# EAGLE design RndLogo (EAGLE 5.11)
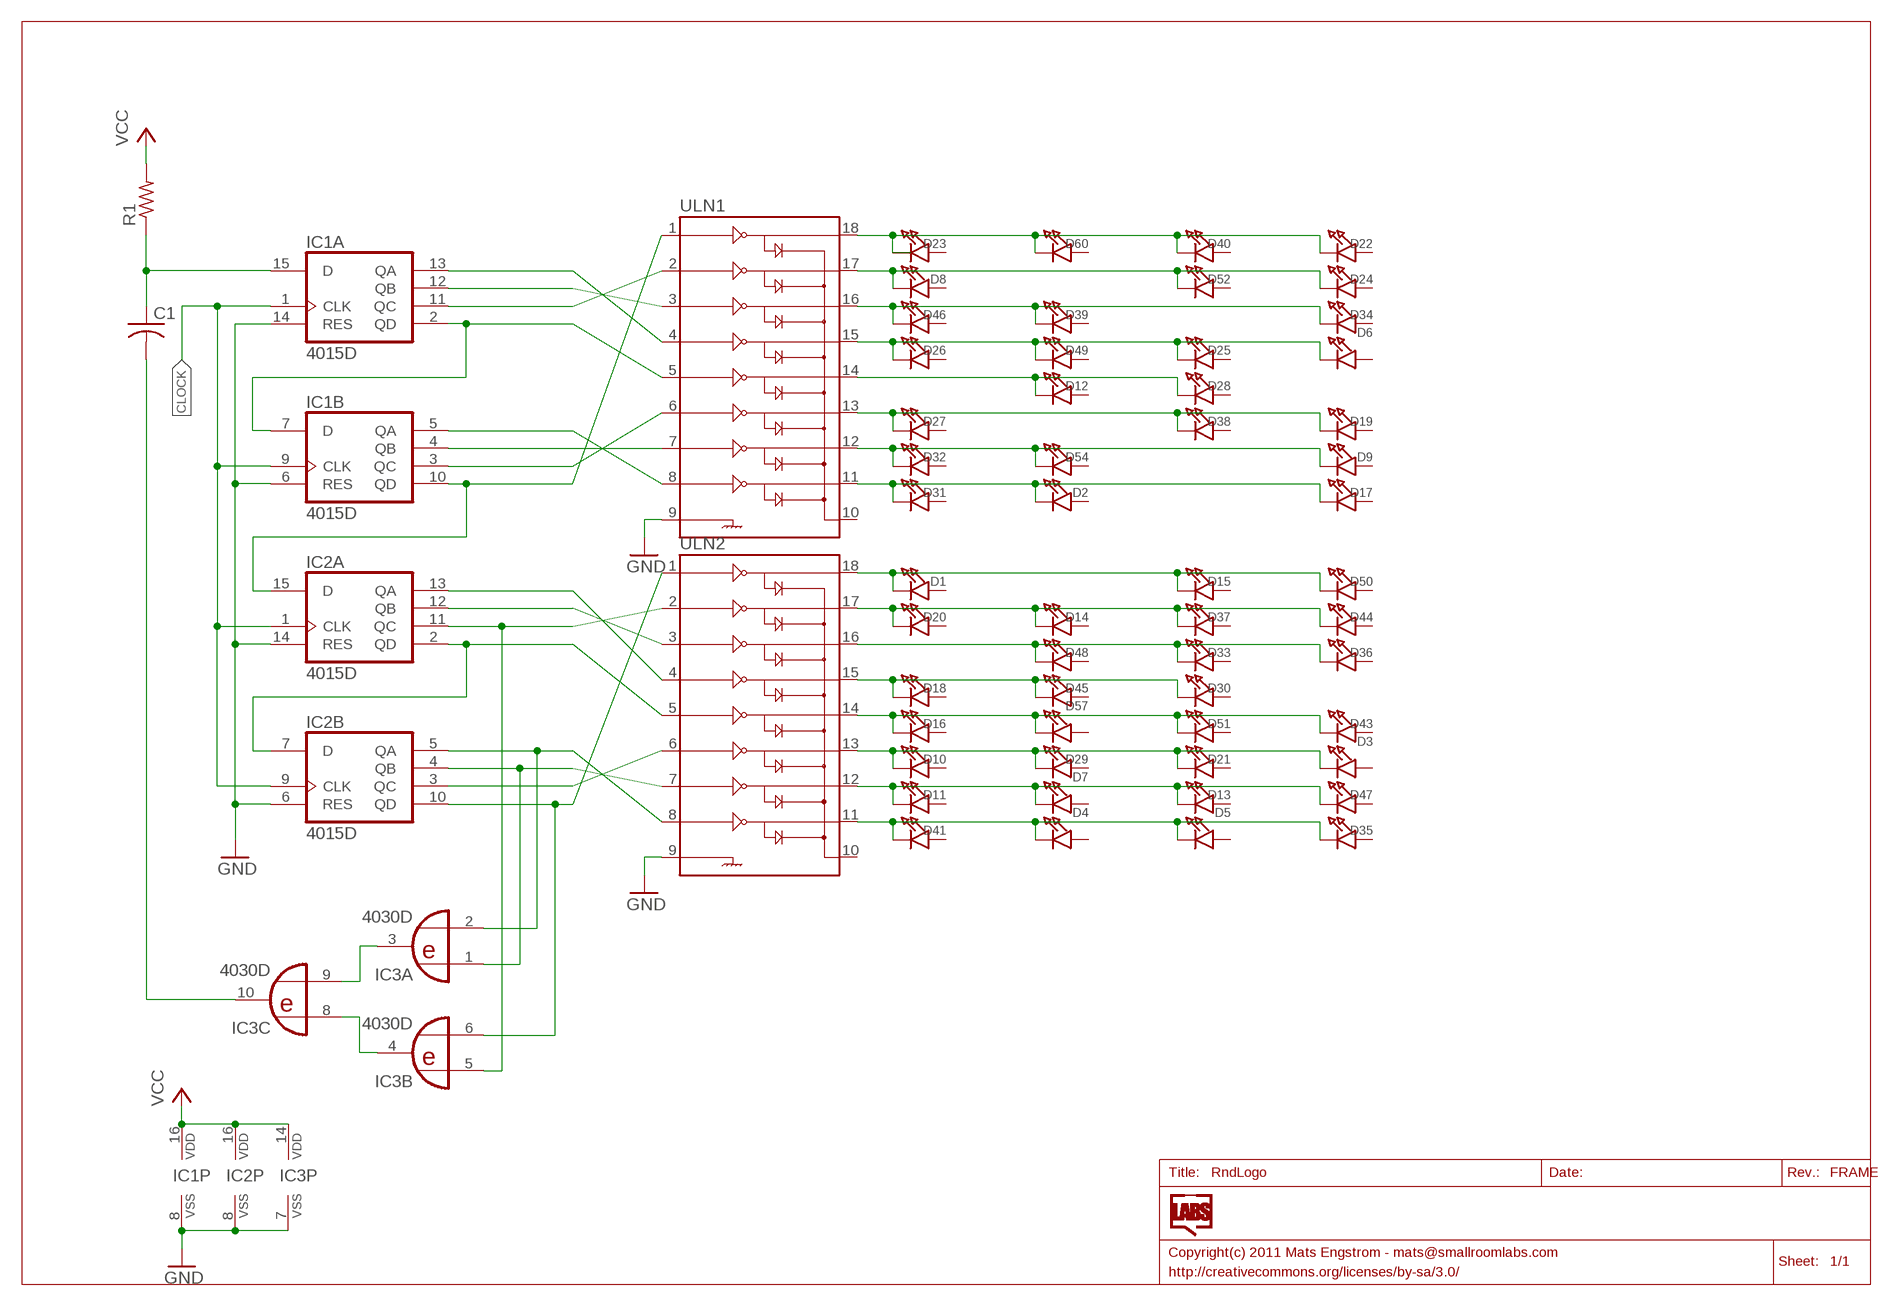
[diagram p0: schematic, sheet 1, part 1 of 2]
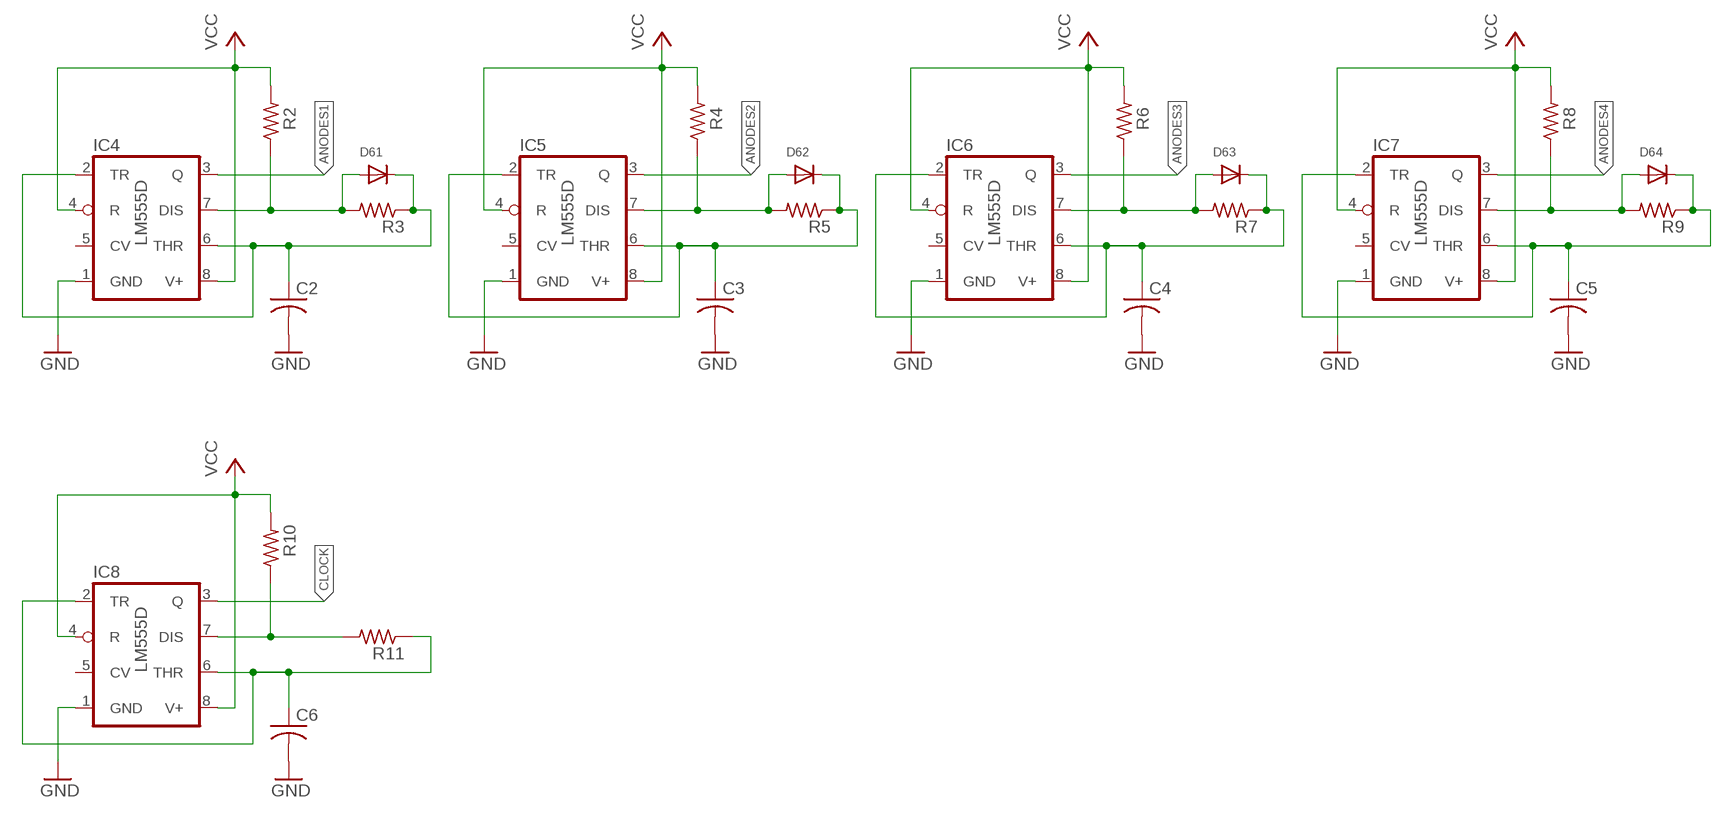
[diagram p1: schematic, sheet 1, part 2 of 2]

## Parts
C1  C-USC0805K  [C0805K]
C2  C-USC0805K  [C0805K]
C3  C-USC0805K  [C0805K]
C4  C-USC0805K  [C0805K]
C5  C-USC0805K  [C0805K]
C6  C-USC0805K  [C0805K]
D1  LEDSMD0805  [CHIPLED_0805]
D2  LEDSMD0805  [CHIPLED_0805]
D3  LEDSMD0805  [CHIPLED_0805]
D4  LEDSMD0805  [CHIPLED_0805]
D5  LEDSMD0805  [CHIPLED_0805]
D6  LEDSMD0805  [CHIPLED_0805]
D7  LEDSMD0805  [CHIPLED_0805]
D8  LEDSMD0805  [CHIPLED_0805]
D9  LEDSMD0805  [CHIPLED_0805]
D10  LEDSMD0805  [CHIPLED_0805]
D11  LEDSMD0805  [CHIPLED_0805]
D12  LEDSMD0805  [CHIPLED_0805]
D13  LEDSMD0805  [CHIPLED_0805]
D14  LEDSMD0805  [CHIPLED_0805]
D15  LEDSMD0805  [CHIPLED_0805]
D16  LEDSMD0805  [CHIPLED_0805]
D17  LEDSMD0805  [CHIPLED_0805]
D18  LEDSMD0805  [CHIPLED_0805]
D19  LEDSMD0805  [CHIPLED_0805]
D20  LEDSMD0805  [CHIPLED_0805]
D21  LEDSMD0805  [CHIPLED_0805]
D22  LEDSMD0805  [CHIPLED_0805]
D23  LEDSMD0805  [CHIPLED_0805]
D24  LEDSMD0805  [CHIPLED_0805]
D25  LEDSMD0805  [CHIPLED_0805]
D26  LEDSMD0805  [CHIPLED_0805]
D27  LEDSMD0805  [CHIPLED_0805]
D28  LEDSMD0805  [CHIPLED_0805]
D29  LEDSMD0805  [CHIPLED_0805]
D30  LEDSMD0805  [CHIPLED_0805]
D31  LEDSMD0805  [CHIPLED_0805]
D32  LEDSMD0805  [CHIPLED_0805]
D33  LEDSMD0805  [CHIPLED_0805]
D34  LEDSMD0805  [CHIPLED_0805]
D35  LEDSMD0805  [CHIPLED_0805]
D36  LEDSMD0805  [CHIPLED_0805]
D37  LEDSMD0805  [CHIPLED_0805]
D38  LEDSMD0805  [CHIPLED_0805]
D39  LEDSMD0805  [CHIPLED_0805]
D40  LEDSMD0805  [CHIPLED_0805]
D41  LEDSMD0805  [CHIPLED_0805]
D43  LEDSMD0805  [CHIPLED_0805]
D44  LEDSMD0805  [CHIPLED_0805]
D45  LEDSMD0805  [CHIPLED_0805]
D46  LEDSMD0805  [CHIPLED_0805]
D47  LEDSMD0805  [CHIPLED_0805]
D48  LEDSMD0805  [CHIPLED_0805]
D49  LEDSMD0805  [CHIPLED_0805]
D50  LEDSMD0805  [CHIPLED_0805]
D51  LEDSMD0805  [CHIPLED_0805]
D52  LEDSMD0805  [CHIPLED_0805]
D54  LEDSMD0805  [CHIPLED_0805]
D57  LEDSMD0805  [CHIPLED_0805]
D60  LEDSMD0805  [CHIPLED_0805]
D61  DIODESOD-123  [SOD-123]
D62  DIODESOD-123  [SOD-123]
D63  DIODESOD-123  [SOD-123]
D64  DIODESOD-123  [SOD-123]
IC1  4015D  [SO16]
IC2  4015D  [SO16]
IC3  4030D  [SO14]
IC4  LM555D  [SO08]
IC5  LM555D  [SO08]
IC6  LM555D  [SO08]
IC7  LM555D  [SO08]
IC8  LM555D  [SO08]
R1  R-US_R0805W  [R0805W]
R2  R-US_R0805W  [R0805W]
R3  R-US_R0805W  [R0805W]
R4  R-US_R0805W  [R0805W]
R5  R-US_R0805W  [R0805W]
R6  R-US_R0805W  [R0805W]
R7  R-US_R0805W  [R0805W]
R8  R-US_R0805W  [R0805W]
R9  R-US_R0805W  [R0805W]
R10  R-US_R0805W  [R0805W]
R11  R-US_R0805W  [R0805W]
ULN1  ULN2803SOICW  [SO18L]
ULN2  ULN2803SOICW  [SO18L]

## Nets
ANODES1: IC4.3(Q)
ANODES2: IC5.3(Q)
ANODES3: IC6.3(Q)
ANODES4: IC7.3(Q)
CLOCK: IC1.1(A:CLK) IC1.9(B:CLK) IC2.1(A:CLK) IC2.9(B:CLK) IC8.3(Q)
GND: C2.2 C3.2 C4.2 C5.2 C6.2 IC1.6(B:RES) IC1.8(P:VSS) IC1.14(A:RES) IC2.6(B:RES) IC2.8(P:VSS) IC2.14(A:RES) IC3.7(P:VSS) IC4.1(GND) IC5.1(GND) IC6.1(GND) IC7.1(GND) IC8.1(GND) ULN1.9 ULN2.9
N$1: D63.A IC6.7(DIS) R6.1 R7.2
N$2: IC3.3(A:O) IC3.9(C:I1)
N$3: IC3.4(B:O) IC3.8(C:I0)
N$4: C1.1 IC1.15(A:D) R1.1
N$5: C4.1 D63.C IC6.2(TR) IC6.6(THR) R7.1
N$6: D62.A IC5.7(DIS) R4.1 R5.2
N$7: C3.1 D62.C IC5.2(TR) IC5.6(THR) R5.1
N$8: C1.2 IC3.10(C:O)
N$9: D22.C D40.C D60.C ULN1.18
N$10: D61.A IC4.7(DIS) R2.1 R3.2
N$11: C2.1 D61.C IC4.2(TR) IC4.6(THR) R3.1
N$12: D64.A IC7.7(DIS) R8.1 R9.2
N$13: C5.1 D64.C IC7.2(TR) IC7.6(THR) R9.1
N$14: IC8.7(DIS) R10.1 R11.2
N$15: C6.1 IC8.2(TR) IC8.6(THR) R11.1
N$16: D8.C D24.C D52.C ULN1.17
N$17: D34.C D39.C D46.C ULN1.16
N$18: D6.C D25.C D26.C D49.C ULN1.15
N$19: D12.C D28.C ULN1.14
N$20: D19.C D27.C D38.C ULN1.13
N$21: D9.C D32.C D54.C ULN1.12
N$22: D2.C D17.C D31.C ULN1.11
N$23: D1.C D15.C D50.C ULN2.18
N$24: D14.C D20.C D37.C D44.C ULN2.17
N$25: D33.C D36.C D48.C ULN2.16
N$26: D18.C D30.C D45.C ULN2.15
N$27: D16.C D43.C D51.C D57.C ULN2.14
N$28: D3.C D10.C D21.C D29.C ULN2.13
N$29: D7.C D11.C D13.C D47.C ULN2.12
N$30: D4.C D5.C D35.C D41.C ULN2.11
RND0: IC1.13(A:QA) ULN1.4
RND1: IC1.12(A:QB) ULN1.3
RND2: IC1.11(A:QC) ULN1.2
RND3: IC1.2(A:QD) IC1.7(B:D) ULN1.5
RND4: IC1.5(B:QA) ULN1.8
RND5: IC1.4(B:QB) ULN1.7
RND6: IC1.3(B:QC) ULN1.6
RND7: IC1.10(B:QD) IC2.15(A:D) ULN1.1
RND8: IC2.13(A:QA) ULN2.4
RND9: IC2.12(A:QB) ULN2.3
RND10: IC2.11(A:QC) IC3.5(B:I0) ULN2.2
RND11: IC2.2(A:QD) IC2.7(B:D) ULN2.5
RND12: IC2.5(B:QA) IC3.2(A:I1) ULN2.8
RND13: IC2.4(B:QB) IC3.1(A:I0) ULN2.7
RND14: IC2.3(B:QC) ULN2.6
RND15: IC2.10(B:QD) IC3.6(B:I1) ULN2.1
VCC: IC1.16(P:VDD) IC2.16(P:VDD) IC3.14(P:VDD) IC4.4(R) IC4.8(V+) IC5.4(R) IC5.8(V+) IC6.4(R) IC6.8(V+) IC7.4(R) IC7.8(V+) IC8.4(R) IC8.8(V+) R1.2 R2.2 R4.2 R6.2 R8.2 R10.2
Unconnected: D1.A D2.A D3.A D4.A D5.A D6.A D7.A D8.A D9.A D10.A D11.A D12.A D13.A D14.A D15.A D16.A D17.A D18.A D19.A D20.A D21.A D22.A D23.A D23.C D24.A D25.A D26.A D27.A D28.A D29.A D30.A D31.A D32.A D33.A D34.A D35.A D36.A D37.A D38.A D39.A D40.A D41.A D43.A D44.A D45.A D46.A D47.A D48.A D49.A D50.A D51.A D52.A D54.A D57.A D60.A IC3.11(D:O) IC3.12(D:I0) IC3.13(D:I1) IC4.5(CV) IC5.5(CV) IC6.5(CV) IC7.5(CV) IC8.5(CV) ULN1.10 ULN2.10

## Library data of the parts
C1-C6 = rcl:C-US: CAPACITOR, American symbol
D1-D41 D43-D52 D54 D57 D60 = SmallRoomLabs:LED
D61-D64 = microbuilder:DIODE: Diode SMADIODE - SMA Surface Mount Package 20V 1A Schottky Diode Digikey (500mV @ 1A, 500uA Vr @ 20V): 641-1014-6-ND SOD-123 30V 500mA (430mV Vf, 130uA Vr @ 30V) Schottky Diode - Digikey: B0530W-FDICT-ND SOD-323 10V 570mA (380mV Vf, 3ns) Schottky Diode - Digikey: ZLLS410CT-ND SOD-523 30V 30mA Schottky Diode (RB751S-40TE61) - Digikey: RB751S-40TE61CT-ND SOT23-R/W - SOT23 Package (R = Solder Paste/Reflow Ovens, W = Hand-Soldering) BAT54Film 40V 300mA - Digikey: 497-7162-1-ND DO-1N4148 Through Hole Small Current Diode (any model)
IC1 IC2 = 40xx:4015: Dual 4-bit static SHIFT REGISTER
IC3 = 40xx:4030: Quad XOR
IC4-IC8 = linear:*555: TIMER
R1-R11 = rcl:R-US_: RESISTOR, American symbol
ULN1 ULN2 = SparkFun:ULN2803: Darlington Driver ULN2803 Darlington array. 500mA max per channel, 8-channel package. Spark Fun Electronics SKU : COM-00312

## Net classes
0 default: width 0.203 mm, drill 0.305 mm, clearance 0.203 mm

## Board
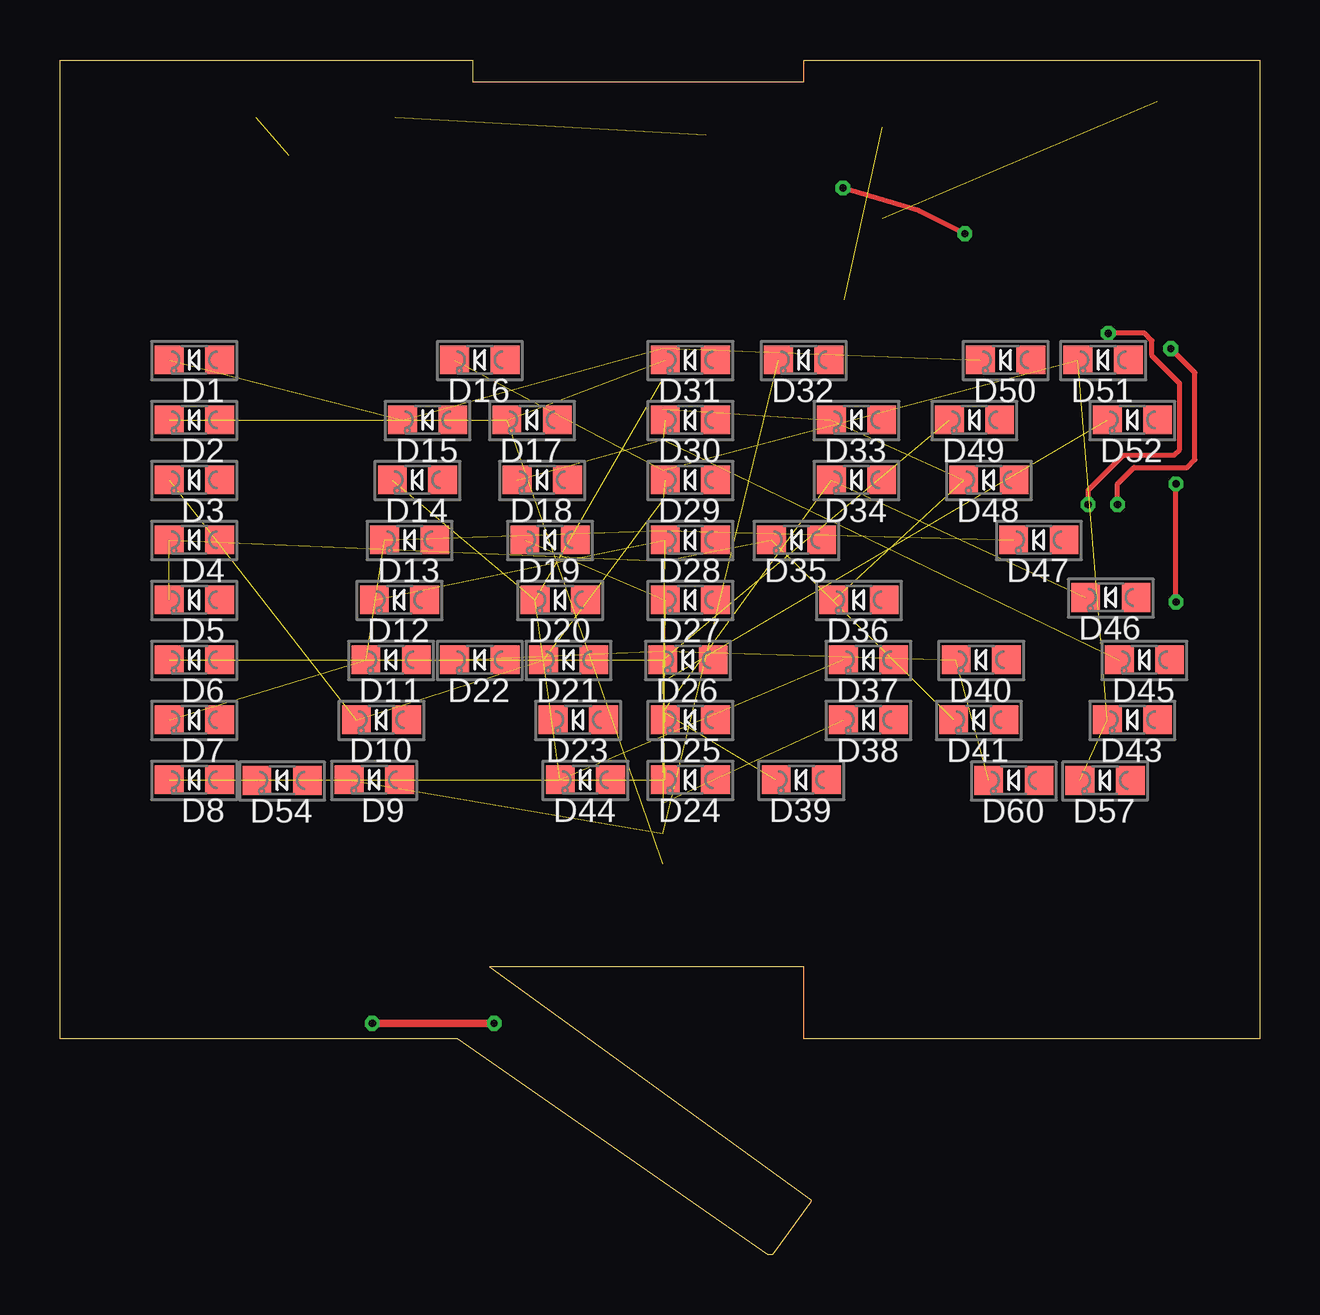
[diagram p2: board, top side]
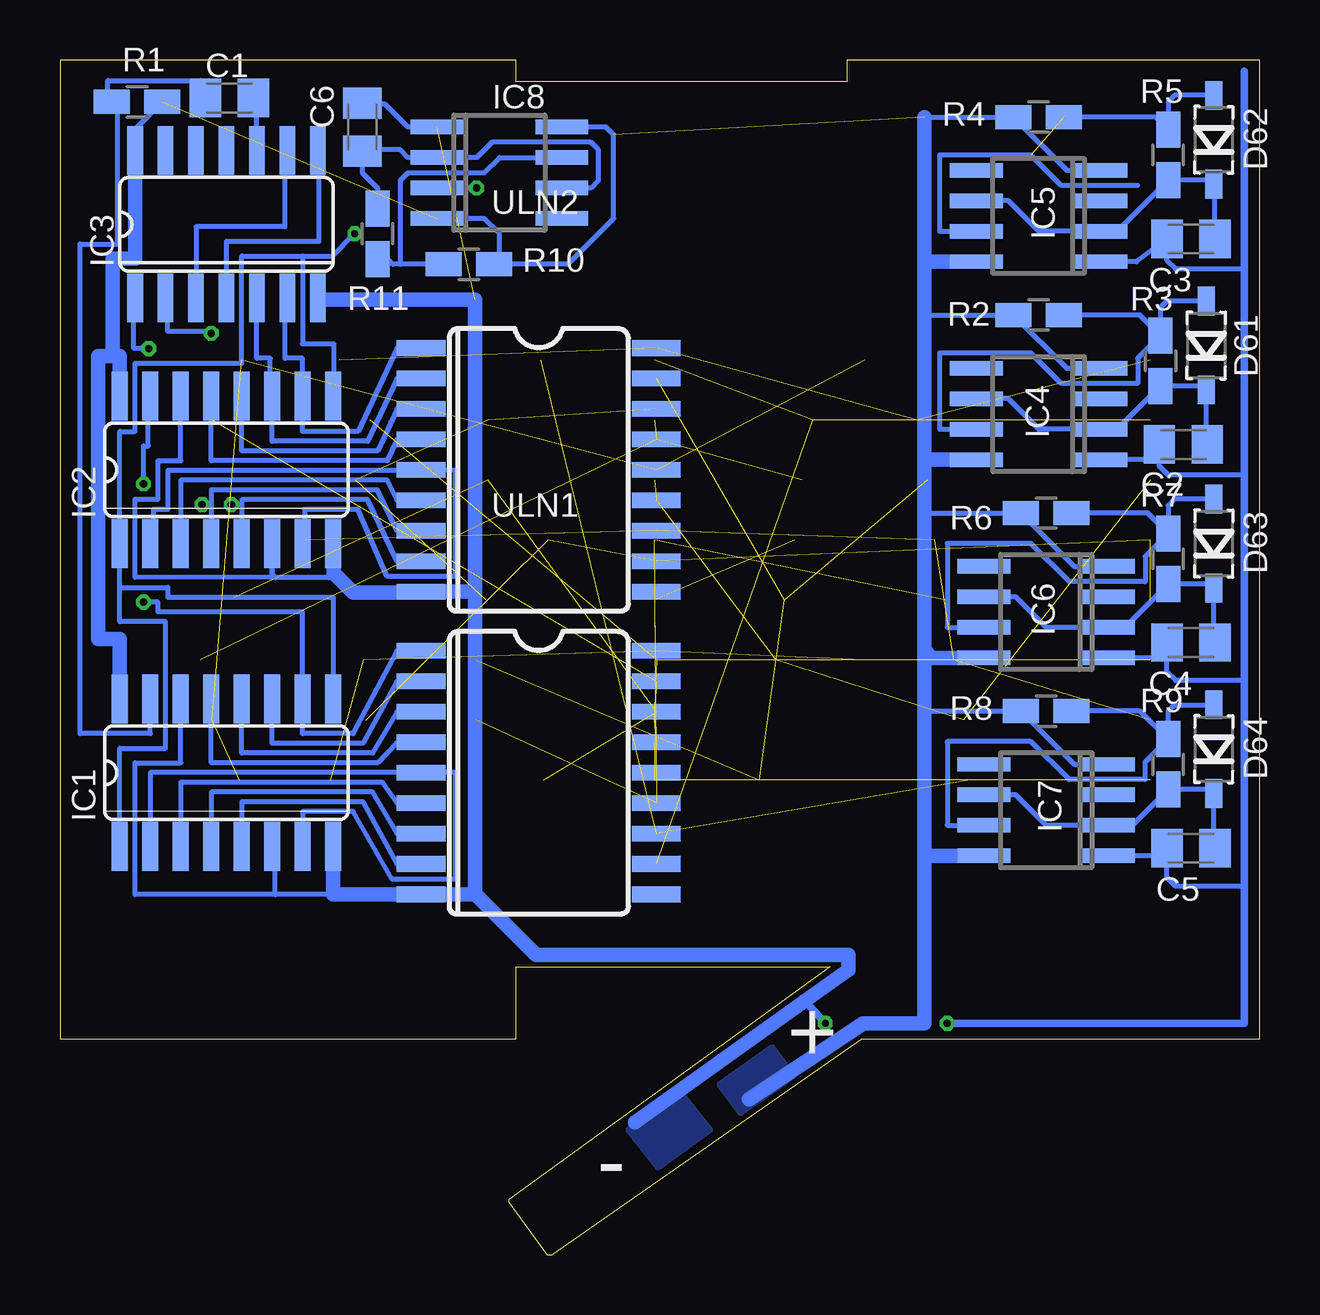
[diagram p3: board, bottom side, seen from below]

Size 50 x 49.8 mm. Coordinates in mm from the lower left corner, seen from the top.
Outline: 50,49.8 50,9 31,9 31,12 17.9,12 31.3,2.3 31.3,2.2 29.7,0 29.5,0 16.57,9 0,9 0,49.8 17.2,49.8 17.2,48.9 31,48.9 31,49.8 50,49.8
Copper layers (1*16): Top 0.035mm / dielectric 1.5mm / Bottom 0.035mm
Design rules "Fusion_eagle_rule_v1.1": minimum track width 6mil, minimum drill 12mil, track to track 6mil, track to pad 6mil, pad to pad 6mil, via to via 6mil, smd to smd 0mil, copper to edge 10mil, drill to drill 10mil, minimum pad ring 10mil, minimum via ring 6mil, stop-mask expansion 2mil, vias tented up to drill 100mil, thermal gap 10mil

### Footprints (pad centres in the part's own frame; a part is rotated, then mirrored left to right if it is on the bottom)
C0805K = smd 1.3 x 1.6: 1 -1,0; 2 1,0
CHIPLED_0805 = smd 1.2 x 1.2: A 0,-1.05; C 0,1.05
SOD-123 = smd 1.2 x 0.7: A 1.85,0; C -1.85,0
SO16 = smd 0.66 x 2.032: 1 -4.445,-3.073; 2 -3.175,-3.073; 3 -1.905,-3.073; 4 -0.635,-3.073; 5 0.635,-3.073; 6 1.905,-3.073; 7 3.175,-3.073; 8 4.445,-3.073; 9 4.445,3.073; 10 3.175,3.073; 11 1.905,3.073; 12 0.635,3.073; 13 -0.635,3.073; 14 -1.905,3.073; 15 -3.175,3.073; 16 -4.445,3.073
SO14 = smd 0.66 x 2.032: 1 -3.81,-3.073; 2 -2.54,-3.073; 3 -1.27,-3.073; 4 0,-3.073; 5 1.27,-3.073; 6 2.54,-3.073; 7 3.81,-3.073; 8 3.81,3.073; 9 2.54,3.073; 10 1.27,3.073; 11 0,3.073; 12 -1.27,3.073; 13 -2.54,3.073; 14 -3.81,3.073
SO08 = smd 0.6 x 2.2: 1 -1.905,-2.6; 2 -0.635,-2.6; 3 0.635,-2.6; 4 1.905,-2.6; 5 1.905,2.6; 6 0.635,2.6; 7 -0.635,2.6; 8 -1.905,2.6
R0805W = smd 1.5 x 1: 1 -1.052,0; 2 1.052,0
SO18L = smd 0.66 x 2.032: 1 -0.635,-4.902; 2 0.635,-4.902; 3 1.905,-4.902; 4 3.175,-4.902; 5 4.445,-4.902; 6 5.715,-4.902; 7 6.985,-4.902; 8 8.255,-4.902; 9 9.525,-4.902; 10 9.525,4.902; 11 8.255,4.902; 12 6.985,4.902; 13 5.715,4.902; 14 4.445,4.902; 15 3.175,4.902; 16 1.905,4.902; 17 0.635,4.902; 18 -0.635,4.902

### Placement (x,y rotation side)
C1  42.93,48.21 0 bottom
C2  3.17,33.77 180 bottom
C3  2.86,42.34 180 bottom
C4  2.86,25.52 180 bottom
C5  2.86,16.95 180 bottom
C6  37.4,47 90 bottom
D1  5.6,37.3 90 top
D2  5.6,34.8 90 top
D3  5.6,32.3 90 top
D4  5.6,29.8 90 top
D5  5.6,27.3 90 top
D6  5.6,24.8 90 top
D7  5.6,22.3 90 top
D8  5.6,19.8 90 top
D9  13.1,19.8 90 top
D10  13.4,22.3 90 top
D11  13.8,24.8 90 top
D12  14.15,27.3 90 top
D13  14.57,29.8 90 top
D14  14.9,32.3 90 top
D15  15.32,34.8 90 top
D16  17.5,37.3 90 top
D17  19.68,34.8 90 top
D18  20.1,32.3 90 top
D19  20.43,29.8 90 top
D20  20.85,27.3 90 top
D21  21.2,24.8 90 top
D22  17.5,24.8 90 top
D23  21.6,22.3 90 top
D24  26.27,19.8 90 top
D25  26.27,22.3 90 top
D26  26.18,24.8 90 top
D27  26.27,27.3 90 top
D28  26.27,29.8 90 top
D29  26.27,32.3 90 top
D30  26.27,34.8 90 top
D31  26.27,37.3 90 top
D32  31,37.3 90 top
D33  33.2,34.8 90 top
D34  33.2,32.3 90 top
D35  30.7,29.8 90 top
D36  33.3,27.3 90 top
D37  33.7,24.8 90 top
D38  33.7,22.3 90 top
D39  30.9,19.8 90 top
D40  38.4,24.8 90 top
D41  38.3,22.3 90 top
D43  44.7,22.3 90 top
D44  21.9,19.8 90 top
D45  45.2,24.8 90 top
D46  43.8,27.4 90 top
D47  40.8,29.8 90 top
D48  38.72,32.3 90 top
D49  38.12,34.8 90 top
D50  39.42,37.3 90 top
D51  43.48,37.3 90 top
D52  44.7,34.8 90 top
D54  9.26,19.78 90 top
D57  43.56,19.78 90 top
D60  39.76,19.78 90 top
D61  2.22,37.9 90 bottom
D62  1.91,46.47 90 bottom
D63  1.91,29.64 90 bottom
D64  1.91,21.07 90 bottom
IC1  43.06,20.09 0 bottom
IC2  43.06,32.72 0 bottom
IC3  43.06,42.95 0 bottom
IC4  9.21,35.04 90 bottom
IC5  9.21,43.3 90 bottom
IC6  8.89,26.79 90 bottom
IC7  8.89,18.53 90 bottom
IC8  31.68,45.1 270 bottom
R1  46.78,48.06 0 bottom
R2  9.21,39.17 180 bottom
R3  4.13,37.27 90 bottom
R4  9.21,47.42 180 bottom
R5  3.81,45.84 90 bottom
R6  8.89,30.91 180 bottom
R7  3.81,29.01 90 bottom
R8  8.89,22.66 180 bottom
R9  3.81,20.44 90 bottom
R10  32.95,41.29 0 bottom
R11  36.76,42.56 270 bottom
ULN1  30.04,24.54 270 bottom
ULN2  30.04,37.16 270 bottom

### Tracks (layer width: path | path; a pad name or v marks a point on that pad's centre or on a via)
CLOCK  (via drill 0.3 pad 0.3)
  Top 0.203: v37.72,42.56 35.81,43.51 v32.63,44.46
  Bottom 0.203: 38.59,23.17 IC1.9 38.62,27.41 45.5,27.41 45.5,27.81 47.51,27.81 | IC1.1 47.51,21.11 45.6,21.11 45.6,26.39 47.51,26.39 47.51,27.81 | 39.89,41.63 39.89,37.97 38.59,37.97 38.59,35.79 IC2.9 | 39.89,41.63 42.43,41.63 42.43,37.16 46.87,37.16 46.87,34.32 47.51,34.32 IC2.1 47.51,27.81 | 39.89,41.63 38.64,41.63 v37.72,42.56 | v32.63,44.46 IC8.3
GND  (via drill 0.3)  (1 unrouted)
  Top 0.305: v13.02,9.64 v18.1,9.64
  Bottom 0.203: 38.59,29.64 IC2.8 | 38.62,15.01 41.03,15.01 | 41.03,15.01 41.03,17.02 IC1.6 | IC1.14 44.97,20.5 46.87,20.5 46.87,15.01 41.03,15.01 | IC2.14 44.97,33.1 45.91,33.1 45.91,31.5 46.87,31.5 46.87,28.25 41.16,28.22 IC2.6 41.16,28.35 41.03,28.22 38.79,28.22 38.59,28.42 | ULN2.9 34.98,27.61 | 39.25,39.8 IC3.7 | IC8.1 35.49,47 36.45,47.96 37.35,47.96 C6.2 | IC6.1 4.49,24.88 C4.2 3.86,24.3 3.49,23.93 0.64,23.93 | IC4.1 4.81,33.14 C2.2 4.17,32.87 3.81,32.5 0.64,32.5 | IC5.1 5.13,41.39 C3.2 3.86,41.44 3.49,41.07 0.64,41.07 | IC7.1 4.17,16.63 C5.2 3.86,15.72 3.49,15.36 0.64,15.36
  Bottom 0.305: 0.64,49.33 0.64,41.07 0.64,32.5 0.64,23.93 0.64,15.36 0.64,9.64 v13.02,9.64 | v18.1,9.64 18.95,10.58
  Bottom 0.61: IC1.8 38.62,15.01 ULN1.9 32.7,15.01 | 32.7,27.64 ULN2.9 35.01,27.61 37.78,27.61 38.59,28.42 38.59,29.64 | 32.7,15.01 32.7,27.64 | 39.25,39.8 32.7,39.8 32.7,27.64 | 32.7,15.01 32.67,15.01 30.16,12.5 17.14,12.5 17.14,11.87 18.95,10.58 26.04,5.51
  pour Bottom: 26.35,5.2 25.08,3.61 22.86,5.2 24.13,6.79
N$1
  Bottom 0.203: D63.A 3.55,31.5 3.81,31.23 R7.2 | R6.1 4.66,30.91 R7.2 | IC6.7 13.02,26.15 13.02,29.64 9.53,29.64 7.94,28.06 4.76,28.06 4.76,29.11 R7.2
N$2
  Bottom 0.203: IC3.3 44.33,42.85 40.62,42.85 40.62,46.03 IC3.9
N$3
  Bottom 0.203: IC3.4 43.06,42.24 39.2,42.24 39.2,46.03 IC3.8
N$4
  Bottom 0.203: IC1.15 46.24,21.72 49.16,21.72 49.16,42.13 47.6,42.13 47.6,48.06 R1.1 48.01,48.06 48.01,48.94 44.14,48.94 C1.1
N$5
  Bottom 0.203: C4.1 1.91,25.57 D63.C 2.07,27.96 R7.1 5.62,26.15 IC6.2 8.89,26.15 10.16,27.42 IC6.6
N$6  (1 unrouted)
  Bottom 0.203: D62.A 3.55,48.32 3.81,48.06 R5.2 4.34,47.42 R4.1 | IC5.7 13.34,42.66 13.34,45.84 9.53,45.84 8.26,44.57 5.08,44.57
N$7
  Bottom 0.203: C3.1 1.86,44.57 D62.C 2.07,44.78 R5.1 5.93,42.66 IC5.2 9.21,42.66 10.48,43.93 IC5.6
N$8
  Bottom 0.203: IC3.10 41.79,48.21 C1.2
N$9  (3 unrouted)
N$10
  Bottom 0.203: D61.A 3.87,39.75 4.13,39.49 R3.2 | R2.1 4.98,39.17 R3.2 | IC4.7 13.34,34.41 13.34,37.58 9.53,37.58 8.26,36.31 5.08,36.31 5.08,37.36 R3.2
N$11
  Bottom 0.203: C2.1 2.22,33.82 D61.C 2.38,36.21 R3.1 5.93,34.41 IC4.2 9.21,34.41 10.48,35.68 IC4.6
N$12
  Bottom 0.203: D64.A 3.55,22.92 3.81,22.66 R9.2 | R8.1 4.98,22.66 R9.2 | IC7.7 13.02,17.9 13.02,21.39 9.53,21.39 7.94,19.8 4.76,19.8 4.76,20.54 R9.2
N$13
  Bottom 0.203: C5.1 1.91,16.99 D64.C 2.07,19.39 R9.1 5.3,17.9 IC7.2 8.89,17.9 10.16,19.17 IC7.6
N$14
  Bottom 0.203: R11.2 36.34,41.51 36.13,41.29 35.81,41.29 | R10.1 35.81,41.29 | IC8.7 31.68,45.73 32.32,45.1 35.49,45.1 35.81,44.78 35.81,41.29
N$15
  Bottom 0.203: R11.1 36.76,44.46 37.4,45.1 C6.1 37.35,46.05 35.81,46.05 35.49,45.73 IC8.2 32.63,45.73 32,46.37 27.87,46.37 27.55,46.05 27.55,44.78 27.87,44.46 IC8.6
N$16  (3 unrouted)
N$17  (3 unrouted)
N$18  (4 unrouted)
N$19  (2 unrouted)
N$20  (3 unrouted)
N$21  (3 unrouted)
N$22  (3 unrouted)
N$23  (3 unrouted)
N$24  (4 unrouted)
N$25  (3 unrouted)
N$26  (3 unrouted)
N$27  (4 unrouted)
N$28  (4 unrouted)
N$29  (4 unrouted)
N$30  (4 unrouted)
RND0
  Bottom 0.203: IC1.13 43.7,20.5 36.76,20.5 35.95,21.36 ULN1.4
RND1
  Bottom 0.203: IC1.12 42.43,20.91 36.97,20.91 35.95,22.63 ULN1.3
RND2
  Bottom 0.203: IC1.11 41.16,21.31 37.37,21.31 35.95,23.9 ULN1.2
RND3
  Bottom 0.203: IC1.2 46.24,20.09 ULN1.5 33.51,20.09 33.51,15.65 36.15,15.65 37.78,18.47 39.89,18.47 IC1.7
RND4
  Bottom 0.203: IC1.5 42.43,18.87 37.37,18.87 35.95,16.28 ULN1.8
RND5
  Bottom 0.203: IC1.4 43.7,19.28 36.97,19.28 35.95,17.55 ULN1.7
RND6
  Bottom 0.203: IC1.3 44.97,19.69 36.56,19.69 35.95,18.82 ULN1.6
RND7  (via drill 0.3 pad 0.3)
  Top 0.203: v46.52,27.2 v46.52,32.13
  Bottom 0.203: ULN1.1 35.95,25.17 37.78,21.72 39.89,21.72 IC1.10 39.89,26.8 45.91,26.8 45.91,27.2 v46.52,27.2 | 46.11,35.79 IC2.15 46.31,35.79 46.31,33.71 46.52,33.71 v46.52,32.13
RND8
  Bottom 0.203: IC2.13 43.7,33.1 36.36,33.1 35.95,33.99 ULN2.4
RND9
  Bottom 0.203: ULN2.3 35.95,35.26 36.76,33.5 42.43,33.5 IC2.12
RND10
  Bottom 0.203: ULN2.2 35.95,36.53 37.17,33.91 41.16,33.91 IC2.11 41.23,35.79 41.23,37.36 41.79,37.36 IC3.5
RND11
  Bottom 0.203: IC2.7 39.81,29.64 39.81,31.07 37.58,31.07 36.36,28.27 33.51,28.27 33.51,32.69 ULN2.5 34.95,32.69 45.5,32.69 45.5,31.07 46.11,31.07 46.11,29.64 IC2.2
RND12  (via drill 0.3, 0.3 pad 0.3)
  Top 0.203: v43.7,38.41 45.21,38.41 45.52,38.1 45.52,37.47 46.67,36.31 46.67,33.57 46.43,33.33 44.32,33.33 42.86,31.86 v42.86,31.27
  Bottom 0.203: ULN2.8 35.95,28.91 37.17,31.47 42.43,31.47 42.43,31.27 | 42.43,31.27 IC2.5 | 42.43,31.27 v42.86,31.27 | IC3.2 45.5,39.88 45.5,38.48 43.7,38.48 v43.7,38.41
RND13  (via drill 0.3 pad 0.3)
  Top 0.203: v44.08,31.27 44.08,32.13 44.77,32.82 46.99,32.82 47.31,33.14 47.31,36.76 v46.3,37.77
  Bottom 0.203: ULN2.7 35.95,30.18 36.76,31.88 43.7,31.88 43.7,31.27 | 43.7,31.27 IC2.4 | 43.7,31.27 v44.08,31.27 | IC3.1 46.92,39.88 46.92,37.77 v46.3,37.77
RND14
  Bottom 0.203: ULN2.6 35.95,31.45 36.36,32.28 44.97,32.28 IC2.3
RND15
  Bottom 0.203: ULN2.1 35.95,37.8 37.58,34.32 39.89,34.32 IC2.10 39.89,37.36 40.62,37.36 40.62,39.88 IC3.6
VCC  (2 unrouted)
  Bottom 0.203: IC8.4 32.32,43.19 31.68,42.56 31.68,41.51 R10.2 28.82,41.29 26.92,43.19 26.92,46.69 27.24,47 IC8.8 | R1.2 46.79,47.01 46.79,46.11 IC3.14 | IC5.4 8.04,45.2 R4.2 13.97,47.42 | IC4.4 8.04,36.95 R2.2 13.97,39.17 | IC6.4 7.72,28.69 R6.2 13.97,30.91 | IC7.4 7.72,20.44 R8.2 13.97,22.66
  Bottom 0.61: IC1.16 47.51,25.67 48.41,25.67 48.41,37.46 47.8,37.46 | 47.8,37.46 47.8,41.52 46.87,41.52 IC3.14 | IC2.16 47.51,37.46 47.8,37.46 | 13.97,41.39 IC5.8 | 13.97,16.63 13.97,22.66 13.97,25.2 | 13.97,25.2 13.97,30.91 13.97,33.14 | 13.97,33.14 13.97,39.17 13.97,41.39 | 13.97,16.63 IC7.8 | 13.97,33.14 IC4.8 | IC6.8 13.65,24.88 13.97,25.2 | 13.97,41.39 13.97,47.42 | 13.97,16.63 13.97,9.64 16.51,9.64 21.27,6.47
  pour Bottom: 22.54,7.1 20.32,8.69 19.37,7.42 21.59,5.83

### Text on the board
bPlace: + | -